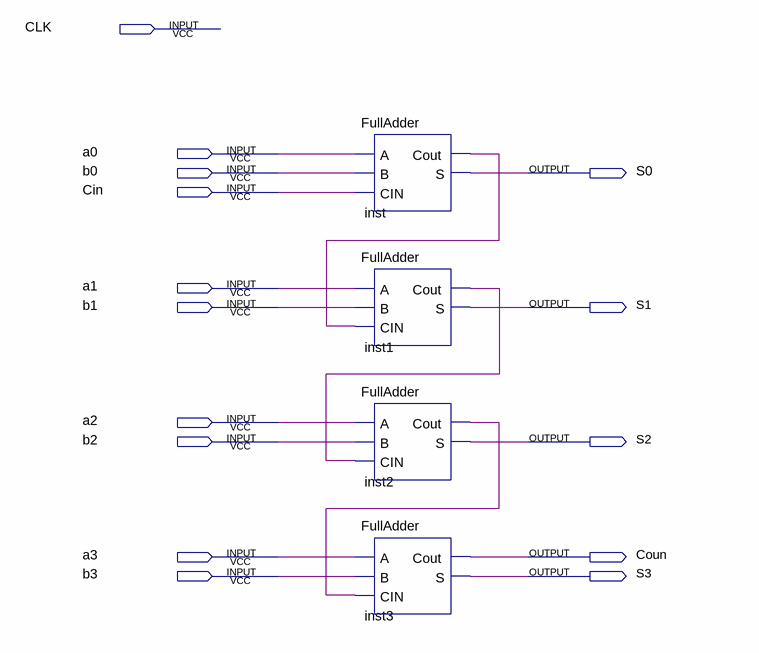
[diagram p0: schematic sheet]
// Quartus schematic FullAdder4.bdf as structural Verilog: 4 symbols, 15 pins
module FullAdder4 (
  input  CLK,
  input  a0,
  input  b0,
  input  Cin,
  input  a1,
  input  b1,
  input  a2,
  input  b2,
  input  a3,
  input  b3,
  output S0,
  output S1,
  output S2,
  output Coun,
  output S3
);

  wire inst1_cout, inst2_cout, inst_cout;

  FullAdder inst (.A(a0), .B(b0), .CIN(Cin), .Cout(inst_cout), .S(S0));
  FullAdder inst1 (.A(a1), .B(b1), .CIN(inst_cout), .Cout(inst1_cout), .S(S1));
  FullAdder inst2 (.A(a2), .B(b2), .CIN(inst1_cout), .Cout(inst2_cout), .S(S2));
  FullAdder inst3 (.A(a3), .B(b3), .CIN(inst2_cout), .Cout(Coun), .S(S3));
endmodule
